# EAGLE design Heater_Driver_BREAKOUT (EAGLE 7.6.0)
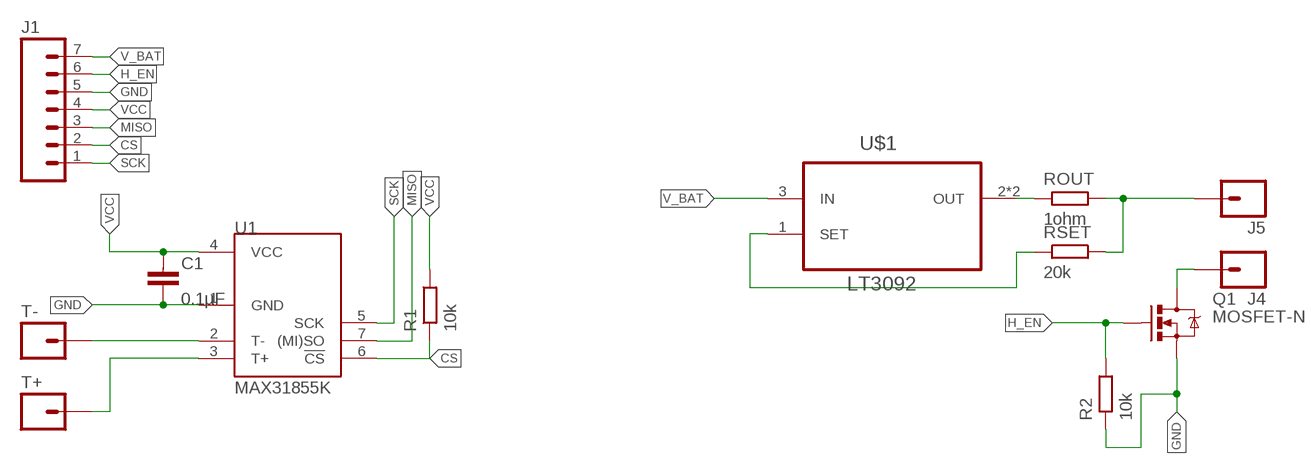
[diagram p0: schematic, sheet 1]

## Parts
C1  0.1µF  CAPACITOR0603-N  [C0603-N]
J1  M07  [1X07]
J4  M01SMD  [LUXEON-PAD]
J5  M01SMD  [LUXEON-PAD]
Q1  MOSFET-N  MOSFET-NCHANNELAO3404A  [SOT23-3]
R1  10k  RESISTOR0603-N  [R0603-N]
R2  10k  RESISTOR0603-N  [R0603-N]
ROUT  1ohm  RESISTOR0603-N  [R0603-N]
RSET  20k  RESISTOR0603-N  [R0603-N]
T+  M01SMD  [LUXEON-PAD]
T-  M01SMD  [LUXEON-PAD]
U1  MAX31855K  [SOIC8]
U$1  LT3092  [SOT223]

## Nets
CS: J1.2 R1.1 U1.6(!CS)
GND: C1.2 J1.5 Q1.2(S) R2.1 U1.1(GND)
H_EN: J1.6 Q1.1(G) R2.2
MISO: J1.3 U1.7((MI)SO)
N$1: T-.P$1 U1.2(T-)
N$2: T+.P$1 U1.3(T+)
N$3: RSET.1 U$1.1(SET)
N$4: ROUT.1 U$1.2(OUT) U$1.4(OUT)
N$6: J5.P$1 ROUT.2 RSET.2
N$8: J4.P$1 Q1.3(D)
SCK: J1.1 U1.5(SCK)
V_BAT: J1.7 U$1.3(IN)
VCC: C1.1 J1.4 R1.2 U1.4(VCC)

## Library data of the parts
C1 = passives-7351:CAPACITOR
J1 = SparkFun-Connectors:M07: Header 7 Standard 7-pin 0.1" header. Use with straight break away headers (SKU : PRT-00116), right angle break away headers (PRT-00553), swiss pins (PRT-00743), machine pins (PRT-00117), and female headers (PRT-00115). NOTES ON THE VARIANTS LOCK and LOCK_LONGPADS... This footprint was designed to help hold the alignment of a through-hole component (i.e. 7-pin header) while soldering it into place. You may notice that each hole has been shifted either up or down by 0.005 of an inch from it's more standard position (which is usually a perfectly straight line). This slight alteration caused the pins (the squares in the middle) to touch the edges of the holes. Because they are alternating, it causes a "brace" to hold the header in place. 0.005 has proven to be the perfect amount of "off-center" position when using our standard breakaway headers. Although looks a little odd when you look at the bare footprint, once you have a header in there, the alteration is very hard to notice. Also, if you push a header all the way into place, it is covered up entirely on the bottom side. This idea of altering the position of holes to aid alignment will be further integrated into the Sparkfun Library for other footprints. It can help hold any component with 3 or more connection pins.
J4 J5 T+ T- = SparkFun-Connectors:M01: Header 1 Standard 1-pin 0.1" header. Use with straight break away headers (SKU : PRT-00116), right angle break away headers (PRT-00553), swiss pins (PRT-00743), machine pins (PRT-00117), and female headers (PRT-00115). SMTSO-256-ET is a "flush mount" nut for a 4-40 screw. The older package used to be too tight, and did not allow it to sit properly thru the drill hit. The latest (0.165DIA) fits nice and snug.
Q1 = SparkFun-DiscreteSemi:MOSFET-NCHANNEL: Common NMOSFET Parts MFG P/N Store ID Prod ID FDD8780 TRANS-09984 SI7820DN TRANS-11055 FDS6630A IC-08089 2N7002PW TRANS-11151 FQP30N06L COM-10213 TRANS-10060 BSS123LT1G TRANS-08345 BSS138 TRANS-00830 BS170 2N7000; PROD_ID: TRAN-12988
R1 R2 ROUT RSET = passives-7351:RESISTOR
U1 = SparkFun-AnalogIC:MAX31855K: Cold-Junction-Compensated K-Thermocoupleto-Digital Converter (-270°C to +1800°C) The MAX31855K performs cold-junction compensation and digitizes the signal from a type-K thermocouple. The data is output in a 14-bit resolution, SPI™-compatible, read-only format. This converter resolves temperatures to 0.25°C, allows readings as high as +1800°C and as low as -270°C, and exhibits thermocouple accuracy of ±2°C for temperatures ranging from -200°C to +700°C for K-type thermocouples.
U$1 = _my-parts:LT3092

## Board
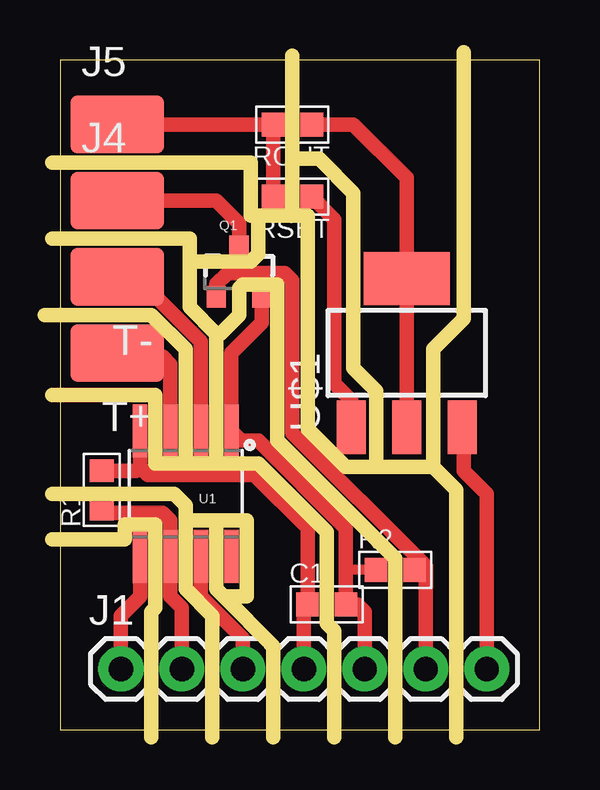
[diagram p1: board, top side]

Size 19.99 x 27.93 mm. Coordinates in mm from the lower left corner, seen from the top.
Outline: 0,0 19.99,0 19.99,27.93 0,27.93 0,0
Copper layers (1*16): Top 0.035mm / dielectric 1.5mm / Bottom 0.035mm
Design rules "default": minimum track width 10mil, minimum drill 24mil, track to track 8mil, track to pad 8mil, pad to pad 8mil, via to via 8mil, smd to smd 8mil, copper to edge 40mil, drill to drill 8mil, minimum pad ring 10mil, minimum via ring 8mil, stop-mask expansion 4mil, vias tented up to drill 0mil, thermal gap 10mil
Milling: 68 lines

### Footprints (pad centres in the part's own frame; a part is rotated, then mirrored left to right if it is on the bottom)
C0603-N = smd 0.95 x 1: 1 -0.8,0; 2 0.8,0
1X07 = drill 1.016 pad 1.88: 1 0,0; 2 2.54,0; 3 5.08,0; 4 7.62,0; 5 10.16,0; 6 12.7,0; 7 15.24,0
LUXEON-PAD = smd 3.9 x 2.4: P$1 0,0
SOT23-3 = smd 0.8 x 0.9: 1 -0.95,-1; 2 0.95,-1; 3 0,1.1
R0603-N = smd 0.95 x 1: 1 -0.8,0; 2 0.8,0
SOIC8 = smd 0.61 x 2.21: 1 -1.905,-2.616; 2 -0.635,-2.616; 3 0.635,-2.616; 4 1.905,-2.616; 5 1.905,2.616; 6 0.635,2.616; 7 -0.635,2.616; 8 -1.905,2.616
SOT223 = smd 1.219 x 2.235: 1 -2.311,-3.099; 2 0,-3.099; 3 2.311,-3.099 | smd 3.6 x 2.2: 4 0,3.099

### Placement (x,y rotation side)
C1  11.11,5.24 0 top
J1  2.54,2.54 0 top
J4  2.38,22.07 0 top
J5  2.38,25.24 0 top
Q1  7.46,19.05 0 top
R1  1.75,10 90 top
R2  13.97,6.67 0 top
ROUT  9.68,25.24 180 top
RSET  9.68,22.23 180 top
T+  2.38,15.72 180 top
T-  2.38,18.89 180 top
U1  5.24,9.84 180 top
U$1  14.45,15.72 0 top

### Tracks (layer width: path | path; a pad name or v marks a point on that pad's centre or on a via)
CS
  Top 0.61: J1.2 5.08,5.08 4.6,5.56 U1.6 4.6,8.73 4.29,9.05 1.9,9.05 R1.1
GND
  Top 0.406: R2.1 11.91,6.67
  Top 0.61: J1.5 12.7,4.92 12.38,5.24 C1.2 11.91,6.67 11.91,8.41 8.26,12.06 7.54,12.06 U1.1 7.14,15.72 8.41,16.99 Q1.2
H_EN
  Top 0.406: R2.2 15.24,6.67
  Top 0.61: Q1.1 6.51,18.58 6.99,19.05 9.37,19.05 9.68,18.73 9.68,12.38 15.24,6.83 15.24,6.67 J1.6
MISO
  Top 0.61: J1.3 7.62,3.81 5.87,5.56 U1.7
N$1
  Top 0.61: U1.2 5.87,16.19 3.49,18.57 2.7,18.57 T-.P$1
N$2
  Top 0.61: U1.3 4.6,15.24 4.29,15.56 2.54,15.56 T+.P$1
N$3
  Top 0.61: U$1.1 12.13,13.74 11.43,14.45 11.43,21.28 RSET.1
N$4
  Top 0.61: ROUT.1 12.22,25.24 14.45,23.02 U$1.4 U$1.2
N$6
  Top 0.61: RSET.2 ROUT.2 J5.P$1
N$8
  Top 0.61: Q1.3 7.46,21.11 6.51,22.07 J4.P$1
SCK
  Top 0.61: J1.1 2.54,4.76 3.33,5.56 U1.5
V_BAT
  Top 0.61: J1.7 17.78,9.84 16.83,10.79 16.83,12.55 U$1.3
VCC
  Top 0.61: J1.4 10.16,5.09 C1.1 10.31,8.42 8.1,10.64 3.65,10.64 3.33,10.95 | 3.33,10.95 U1.4 | R1.2 3.18,10.8 3.33,10.95